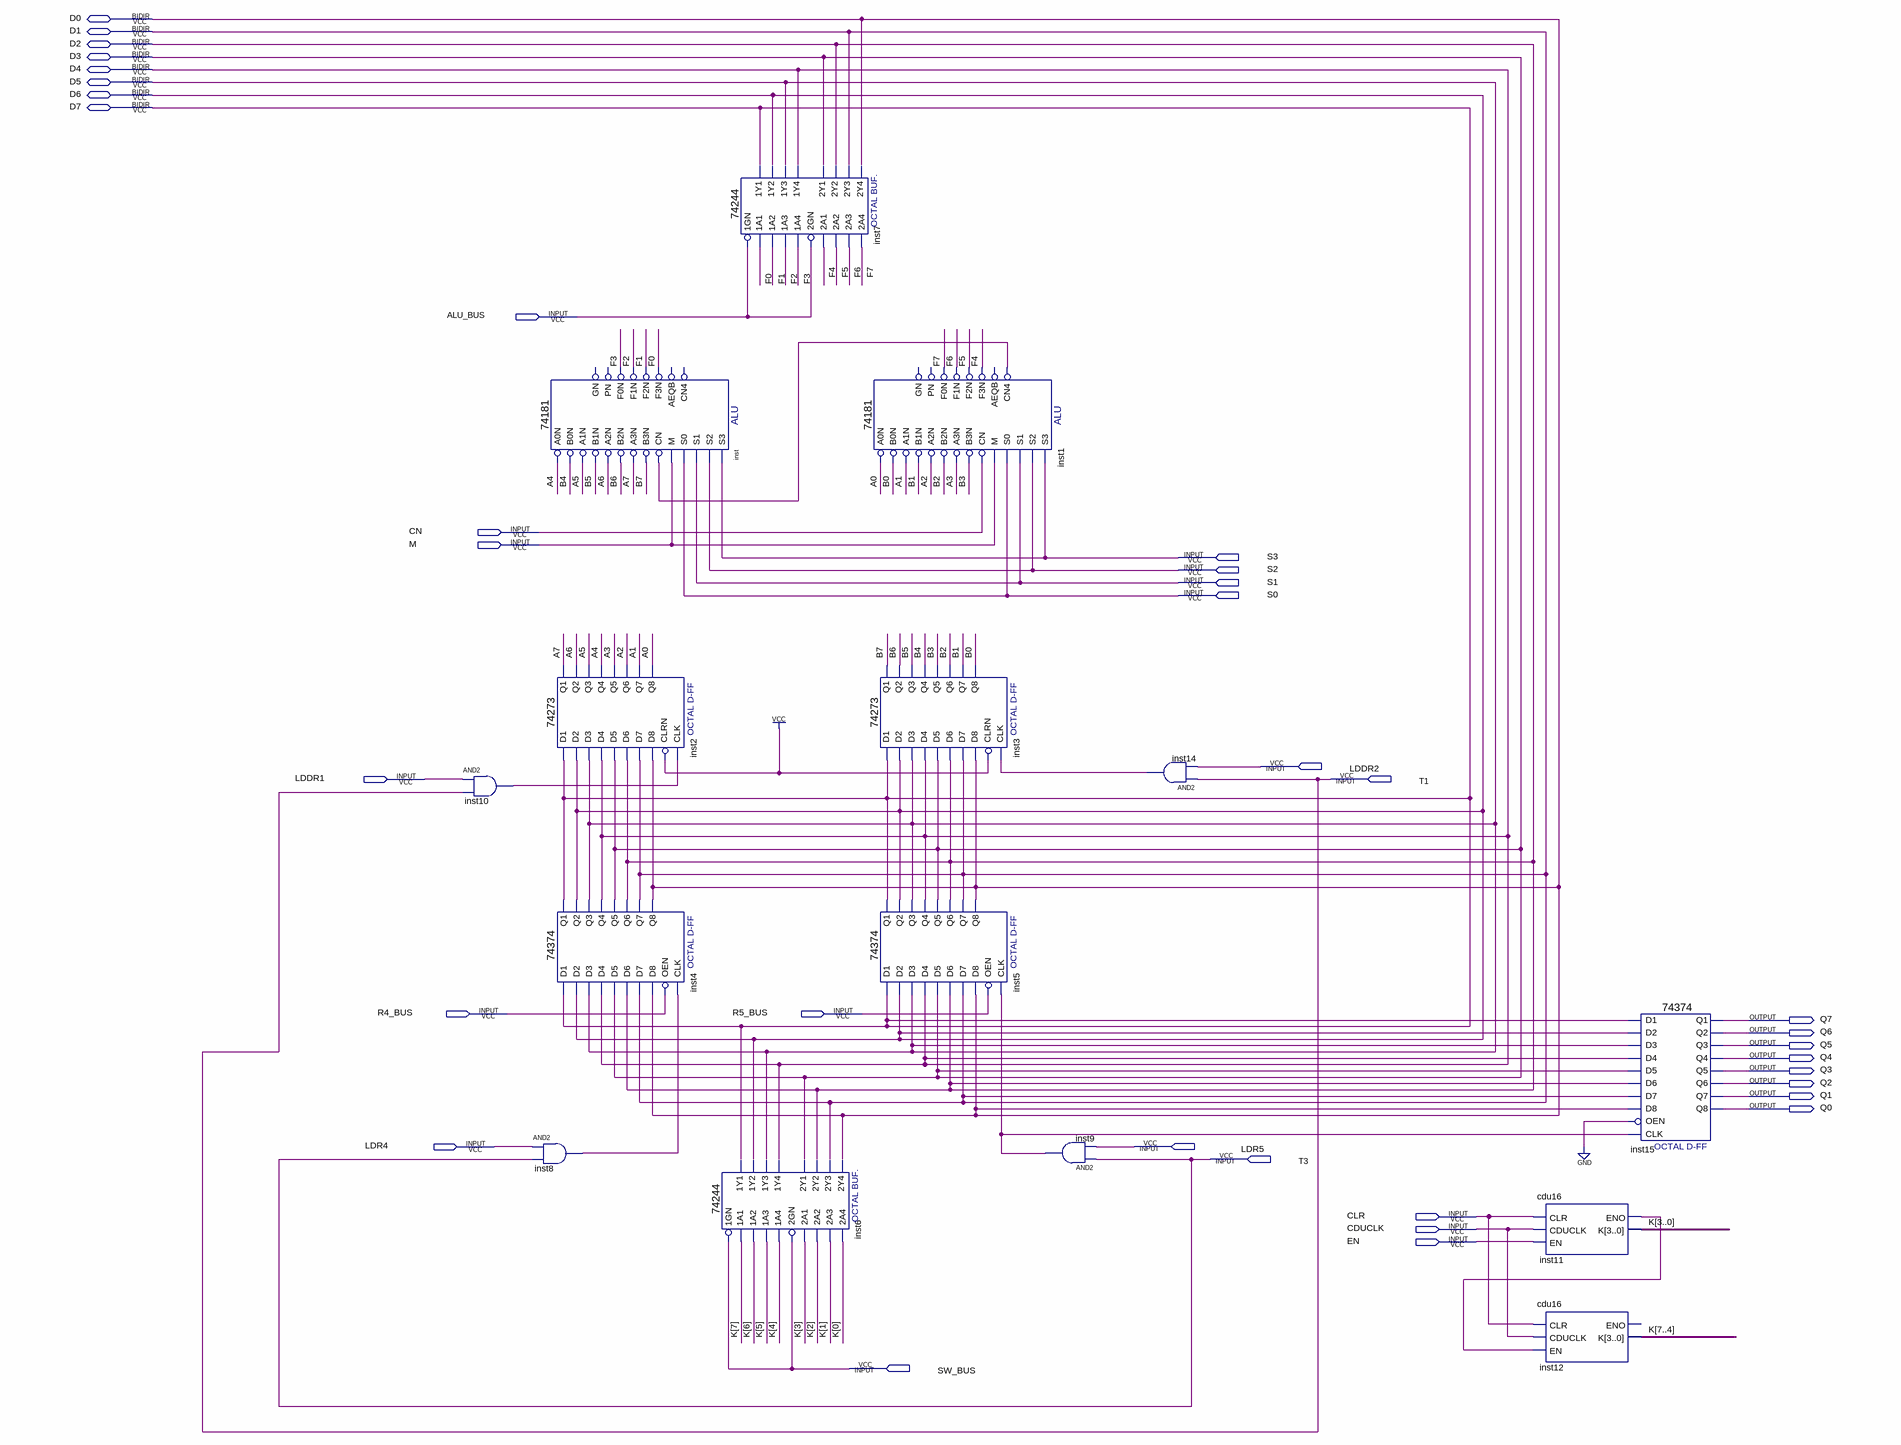
[diagram p0: schematic sheet]
// Quartus schematic exp_alu.bdf as structural Verilog: 15 symbols, 35 pins
module exp_alu (
  input  ALU_BUS,
  input  CN,
  input  M,
  input  S3,
  input  S2,
  input  S1,
  input  S0,
  input  LDDR2,
  input  LDDR1,
  input  T1,
  input  R4_BUS,
  input  R5_BUS,
  input  LDR4,
  input  LDR5,
  input  T3,
  input  CLR,
  input  CDUCLK,
  input  EN,
  input  SW_BUS,
  inout  D0,
  inout  D1,
  inout  D2,
  inout  D3,
  inout  D4,
  inout  D5,
  inout  D6,
  inout  D7,
  output Q7,
  output Q6,
  output Q5,
  output Q4,
  output Q3,
  output Q2,
  output Q1,
  output Q0
);

  wire A0, A1, A2, A3, A4, A5, A6, A7, B0, B1, B2, B3, B4, B5, B6, B7, F0, F1, F2, F3, F4, F5, F6, F7,
       inst1_cn4, inst8_out, inst9_out, inst10_out, inst11_eno, inst14_out;
  wire [7:0] K;

  and inst10 (inst10_out, LDDR1, T1);
  and inst8 (inst8_out, LDR4, T3);
  \74181  inst (
    .B0N(B4), .A0N(A4), .A1N(A5), .B1N(B5), .A3N(A7), .B2N(B6), .A2N(A6), .M(M), .CN(inst1_cn4), .B3N(B7),
    .S2(S2), .S1(S1), .S0(S0), .S3(S3), .F3N(F0), .F1N(F2), .F0N(F3), .F2N(F1));  // open: PN, GN, AEQB, CN4
  \74273  inst2 (
    .D2(D6), .D3(D5), .D1(D7), .D4(D4), .D7(D1), .D6(D2), .D5(D3), .D8(D0), .CLK(inst10_out), .CLRN(1'b1),
    .Q4(A4), .Q1(A7), .Q2(A6), .Q3(A5), .Q6(A2), .Q5(A3), .Q7(A1), .Q8(A0));
  \74374  inst4 (
    .D1(D7), .D2(D6), .D3(D5), .D4(D4), .D6(D2), .D5(D3), .OEN(R4_BUS), .D8(D0), .D7(D1), .CLK(inst8_out),
    .Q2(D6), .Q3(D5), .Q5(D3), .Q4(D4), .Q6(D2), .Q7(D1), .Q8(D0), .Q1(D7));
  \74244  inst7 (
    .\1A2 (F1), .\1A4 (F3), .\1A1 (F0), .\1A3 (F2), .\1GN (ALU_BUS), .\2A3 (F6), .\2GN (ALU_BUS), .\2A1 (F4),
    .\2A4 (F7), .\2A2 (F5), .\1Y2 (D6), .\1Y4 (D4), .\2Y1 (D3), .\1Y1 (D7), .\2Y3 (D1), .\2Y4 (D0),
    .\1Y3 (D5), .\2Y2 (D2));
  \74244  inst6 (
    .\1A2 (K[6]), .\1A4 (K[4]), .\1A1 (K[7]), .\1A3 (K[5]), .\1GN (SW_BUS), .\2A3 (K[1]), .\2GN (SW_BUS),
    .\2A1 (K[3]), .\2A4 (K[0]), .\2A2 (K[2]), .\1Y2 (D6), .\1Y4 (D4), .\2Y1 (D3), .\1Y1 (D7), .\2Y3 (D1),
    .\2Y4 (D0), .\1Y3 (D5), .\2Y2 (D2));
  \74181  inst1 (
    .B0N(B0), .A0N(A0), .A1N(A1), .B1N(B1), .A3N(A3), .B2N(B2), .A2N(A2), .M(M), .CN(CN), .B3N(B3), .S2(S2),
    .S1(S1), .S0(S0), .S3(S3), .F3N(F4), .F1N(F6), .F0N(F7), .CN4(inst1_cn4), .F2N(F5));  // open: PN, GN, AEQB
  \74273  inst3 (
    .D2(D6), .D3(D5), .D1(D7), .D4(D4), .D7(D1), .D6(D2), .D5(D3), .D8(D0), .CLK(inst14_out), .CLRN(1'b1),
    .Q4(B4), .Q1(B7), .Q2(B6), .Q3(B5), .Q6(B2), .Q5(B3), .Q7(B1), .Q8(B0));
  \74374  inst5 (
    .D1(D7), .D2(D6), .D3(D5), .D4(D4), .D6(D2), .D5(D3), .OEN(R5_BUS), .D8(D0), .D7(D1), .CLK(inst9_out),
    .Q2(D6), .Q3(D5), .Q5(D3), .Q4(D4), .Q6(D2), .Q7(D1), .Q8(D0), .Q1(D7));
  and inst9 (inst9_out, T3, LDR5);
  and inst14 (inst14_out, T1, LDDR2);
  cdu16 inst11 (.CLR(CLR), .CDUCLK(CDUCLK), .EN(EN), .ENO(inst11_eno), .K(K[3:0]));
  cdu16 inst12 (.CLR(CLR), .CDUCLK(CDUCLK), .EN(inst11_eno), .K(K[7:4]));  // open: ENO
  \74374  inst15 (
    .D1(D7), .D2(D6), .D3(D5), .D4(D4), .D6(D2), .D5(D3), .OEN(1'b0), .D8(D0), .D7(D1), .CLK(inst9_out),
    .Q2(Q6), .Q3(Q5), .Q5(Q3), .Q4(Q4), .Q6(Q2), .Q7(Q1), .Q8(Q0), .Q1(Q7));
endmodule
